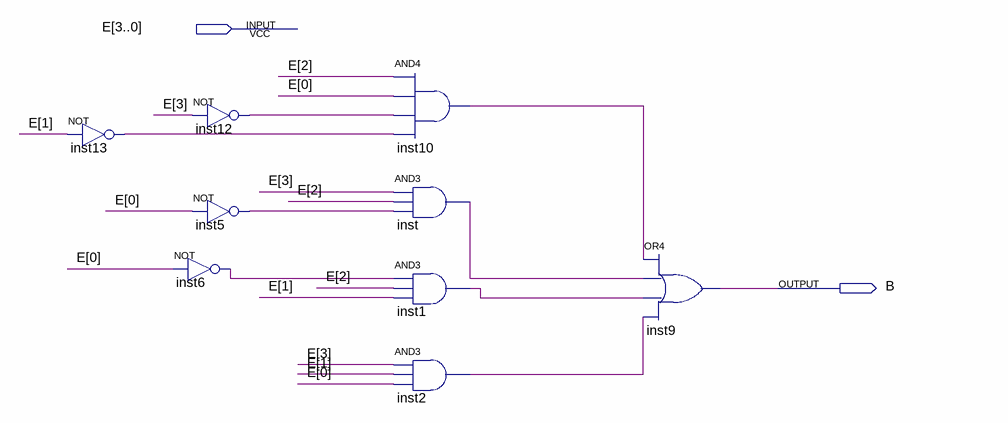
[diagram p0: schematic sheet]
// Quartus schematic displayB.bdf as structural Verilog: 9 symbols, 2 pins
module displayB (
  input  [3:0] E,
  output B
);

  wire inst1_out, inst2_out, inst5_out, inst6_out, inst10_out, inst12_out, inst13_out, inst_out;

  not inst13 (inst13_out, E[1]);
  not inst12 (inst12_out, E[3]);
  not inst5 (inst5_out, E[0]);
  not inst6 (inst6_out, E[0]);
  and inst10 (inst10_out, E[2], E[0], inst12_out, inst13_out);
  and inst (inst_out, E[3], E[2], inst5_out);
  and inst1 (inst1_out, inst6_out, E[2], E[1]);
  and inst2 (inst2_out, E[3], E[1], E[0]);
  or inst9 (B, inst10_out, inst_out, inst1_out, inst2_out);
endmodule
